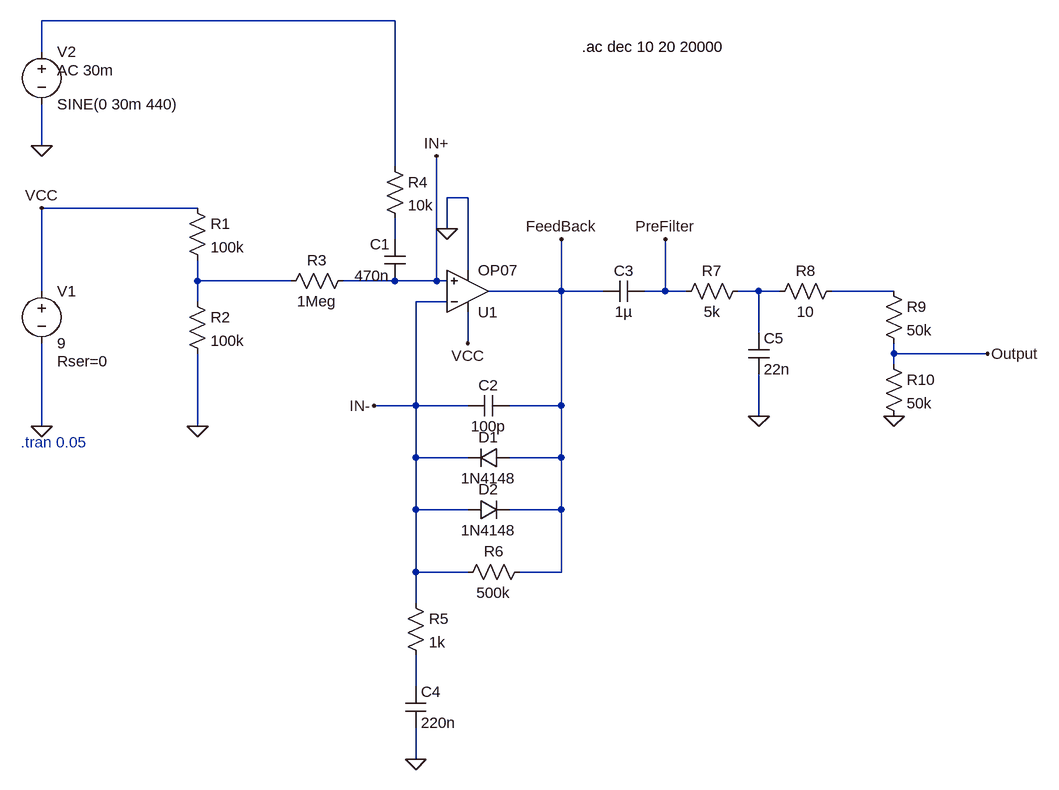
[diagram p0: schematic SimulationDesign.asc]
SimulationDesign.asc, the LTspice schematic file:
Version 4.1
SHEET 1 1588 836
WIRE 576 -320 32 -320
WIRE 32 -272 32 -320
WIRE 32 -128 32 -192
WIRE 576 -96 576 -320
WIRE 688 -48 656 -48
WIRE 272 -32 32 -32
WIRE 656 0 656 -48
WIRE 576 16 576 -16
WIRE 688 64 688 -48
WIRE 272 80 272 48
WIRE 416 80 272 80
WIRE 576 80 496 80
WIRE 640 80 640 -112
WIRE 640 80 576 80
WIRE 656 80 640 80
WIRE 32 96 32 -32
WIRE 832 96 832 16
WIRE 832 96 720 96
WIRE 896 96 832 96
WIRE 992 96 992 16
WIRE 992 96 960 96
WIRE 1024 96 992 96
WIRE 1136 96 1104 96
WIRE 1168 96 1136 96
WIRE 1344 96 1248 96
WIRE 272 112 272 80
WIRE 656 112 608 112
WIRE 1136 160 1136 96
WIRE 688 176 688 128
WIRE 1344 192 1344 176
WIRE 1488 192 1344 192
WIRE 1344 208 1344 192
WIRE 608 272 608 112
WIRE 608 272 544 272
WIRE 688 272 608 272
WIRE 832 272 832 96
WIRE 832 272 752 272
WIRE 1136 288 1136 224
WIRE 32 304 32 176
WIRE 272 304 272 192
WIRE 608 352 608 272
WIRE 688 352 608 352
WIRE 832 352 832 272
WIRE 832 352 752 352
WIRE 608 432 608 352
WIRE 688 432 608 432
WIRE 832 432 832 352
WIRE 832 432 752 432
WIRE 608 528 608 432
WIRE 688 528 608 528
WIRE 832 528 832 432
WIRE 832 528 768 528
WIRE 608 576 608 528
WIRE 608 704 608 656
WIRE 608 816 608 768
FLAG 32 304 0
FLAG 272 304 0
FLAG 656 0 0
FLAG 32 -32 VCC
FLAG 688 176 VCC
FLAG 32 -128 0
FLAG 608 816 0
FLAG 1136 288 0
FLAG 1344 288 0
FLAG 1488 192 Output
FLAG 992 16 PreFilter
FLAG 640 -112 IN+
FLAG 544 272 IN-
FLAG 832 16 FeedBack
SYMBOL voltage 32 80 R0
WINDOW 123 0 0 Left 0
WINDOW 39 24 124 Left 2
SYMATTR InstName V1
SYMATTR Value 9
SYMATTR SpiceLine Rser=0
SYMBOL res 256 -48 R0
SYMATTR InstName R1
SYMATTR Value 100k
SYMBOL res 256 96 R0
SYMATTR InstName R2
SYMATTR Value 100k
SYMBOL res 512 64 R90
WINDOW 0 0 56 VBottom 2
WINDOW 3 32 56 VTop 2
SYMATTR InstName R3
SYMATTR Value 1Meg
SYMBOL cap 592 80 R180
WINDOW 0 24 56 Left 2
WINDOW 3 24 8 Left 2
SYMATTR InstName C1
SYMATTR Value 470n
SYMBOL res 560 -112 R0
SYMATTR InstName R4
SYMATTR Value 10k
SYMBOL voltage 32 -288 R0
WINDOW 123 24 44 Left 2
WINDOW 39 0 0 Left 0
SYMATTR InstName V2
SYMATTR Value SINE(0 30m 440)
SYMATTR Value2 AC 30m
SYMBOL cap 752 256 R90
WINDOW 0 0 32 VBottom 2
WINDOW 3 32 32 VTop 2
SYMATTR InstName C2
SYMATTR Value 100p
SYMBOL diode 752 336 R90
WINDOW 0 0 32 VBottom 2
WINDOW 3 32 32 VTop 2
SYMATTR InstName D1
SYMATTR Value 1N4148
SYMBOL diode 688 448 R270
WINDOW 0 32 32 VTop 2
WINDOW 3 0 32 VBottom 2
SYMATTR InstName D2
SYMATTR Value 1N4148
SYMBOL res 592 560 R0
SYMATTR InstName R5
SYMATTR Value 1k
SYMBOL res 784 512 R90
WINDOW 0 0 56 VBottom 2
WINDOW 3 32 56 VTop 2
SYMATTR InstName R6
SYMATTR Value 500k
SYMBOL cap 960 80 R90
WINDOW 0 0 32 VBottom 2
WINDOW 3 32 32 VTop 2
SYMATTR InstName C3
SYMATTR Value 1µ
SYMBOL cap 592 704 R0
SYMATTR InstName C4
SYMATTR Value 220n
SYMBOL res 1120 80 R90
WINDOW 0 0 56 VBottom 2
WINDOW 3 32 56 VTop 2
SYMATTR InstName R7
SYMATTR Value 5k
SYMBOL res 1264 80 R90
WINDOW 0 0 56 VBottom 2
WINDOW 3 32 56 VTop 2
SYMATTR InstName R8
SYMATTR Value 10
SYMBOL cap 1120 160 R0
SYMATTR InstName C5
SYMATTR Value 22n
SYMBOL res 1328 80 R0
SYMATTR InstName R9
SYMATTR Value 50k
SYMBOL res 1328 192 R0
SYMATTR InstName R10
SYMATTR Value 50k
SYMBOL OpAmps\\OP07 688 160 M180
SYMATTR InstName U1
TEXT 0 328 Left 2 ;.tran 0.05
TEXT 864 -280 Left 2 !.ac dec 10 20 20000

The netlist it stands for:
* SimulationDesign.asc
V1 VCC 0 9 Rser=0
R1 VCC N003 100k
R2 N003 0 100k
R3 IN+ N003 1Meg
C1 IN+ N002 470n
R4 N001 N002 10k
V2 N001 0 SINE(0 30m 440) AC 30m
C2 FeedBack IN- 100p
D1 FeedBack IN- 1N4148
D2 IN- FeedBack 1N4148
R5 IN- N006 1k
R6 FeedBack IN- 500k
C3 PreFilter FeedBack 1µ
C4 N006 0 220n
R7 N004 PreFilter 5k
R8 N005 N004 10
C5 N004 0 22n
R9 N005 Output 50k
R10 Output 0 50k
X§U1 IN+ IN- VCC 0 FeedBack LT1001  ; OP07, pins In+ In- V+ V- OUT
.model D D
.lib standard.dio
* .tran 0.05
.ac dec 10 20 20000
.lib LTC.lib
.backanno
.end